# EAGLE design Varmo_Screen (EAGLE 7.6.0)
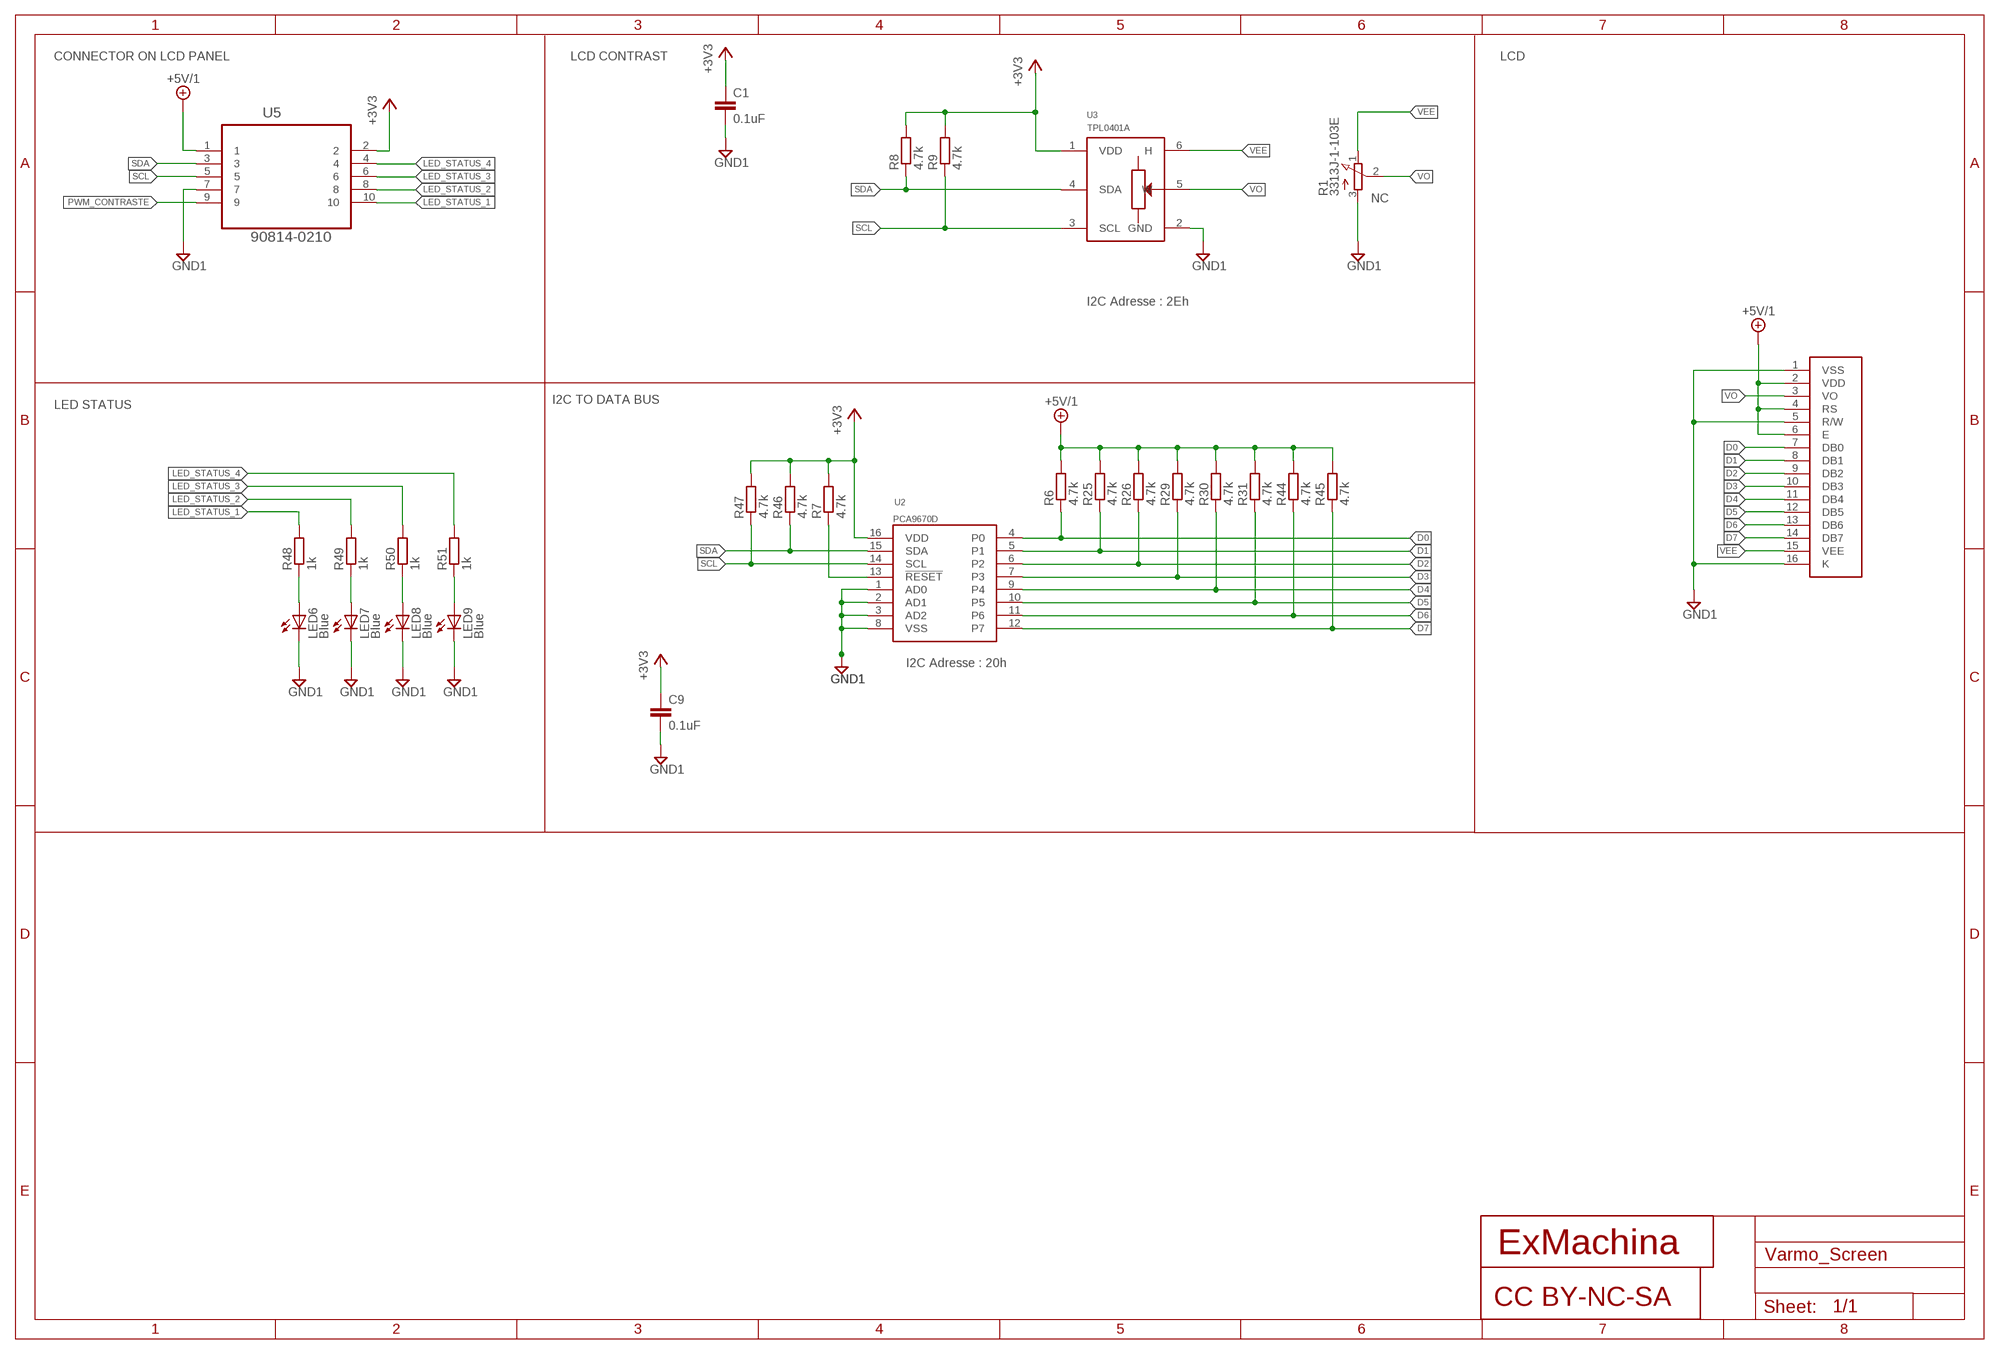
[diagram p0: schematic, sheet 1]

## Parts
C1  0.1uF  C-EUC0603  [C0603]
C9  0.1uF  C-EUC0603  [C0603]
LCD1  MC41605A12W  [CONNECTOR]
LED6  Blue  LEDCHIP-LED0603  [CHIP-LED0603]
LED7  Blue  LEDCHIP-LED0603  [CHIP-LED0603]
LED8  Blue  LEDCHIP-LED0603  [CHIP-LED0603]
LED9  Blue  LEDCHIP-LED0603  [CHIP-LED0603]
R1  3313J-1-103E  [3313J]
R6  4.7k  R-EU_R0603  [R0603]
R7  4.7k  R-EU_R0603  [R0603]
R8  4.7k  R-EU_R0603  [R0603]
R9  4.7k  R-EU_R0603  [R0603]
R25  4.7k  R-EU_R0603  [R0603]
R26  4.7k  R-EU_R0603  [R0603]
R29  4.7k  R-EU_R0603  [R0603]
R30  4.7k  R-EU_R0603  [R0603]
R31  4.7k  R-EU_R0603  [R0603]
R44  4.7k  R-EU_R0603  [R0603]
R45  4.7k  R-EU_R0603  [R0603]
R46  4.7k  R-EU_R0603  [R0603]
R47  4.7k  R-EU_R0603  [R0603]
R48  1k  R-EU_R0603  [R0603]
R49  1k  R-EU_R0603  [R0603]
R50  1k  R-EU_R0603  [R0603]
R51  1k  R-EU_R0603  [R0603]
U2  PCA9670D  [SOT162-1]
U3  TPL0401A  [SC-70-DCK]
U5  90814-0210  [MOLEX_90814-0210]
U$5  CC-BY-NC-SA  [CC-BY-NC-SA]
U$7  EXMACHINA-LOGO-NAME  [EXM-LOGO-BASELINE]

## Nets
+3V3: C1.1 C9.1 R7.2 R8.2 R9.2 R46.2 R47.2 U2.16(VDD) U3.1(VDD) U5.2
+5V/1: LCD1.2(VDD) LCD1.4(RS) LCD1.6(E) R6.2 R25.2 R26.2 R29.2 R30.2 R31.2 R44.2 R45.2 U5.1
D0: LCD1.7(DB0) R6.1 U2.4(P0)
D1: LCD1.8(DB1) R25.1 U2.5(P1)
D2: LCD1.9(DB2) R26.1 U2.6(P2)
D3: LCD1.10(DB3) R29.1 U2.7(P3)
D4: LCD1.11(DB4) R30.1 U2.9(P4)
D5: LCD1.12(DB5) R31.1 U2.10(P5)
D6: LCD1.13(DB6) R44.1 U2.11(P6)
D7: LCD1.14(DB7) R45.1 U2.12(P7)
GND1: C1.2 C9.2 LCD1.1(VSS) LCD1.5(R/W) LCD1.16(K) LED6.C LED7.C LED8.C LED9.C R1.3(A) U2.1(AD0) U2.2(AD1) U2.3(AD2) U2.8(VSS) U3.2(GND) U5.7
LED_STATUS_1: R48.2 U5.10
LED_STATUS_2: R49.2 U5.8
LED_STATUS_3: R50.2 U5.6
LED_STATUS_4: R51.2 U5.4
N$1: R7.1 U2.13(!RESET)
N$4: LED6.A R48.1
N$22: LED7.A R49.1
N$24: LED8.A R50.1
N$29: LED9.A R51.1
PWM_CONTRASTE: U5.9
SCL: R9.1 R47.1 U2.14(SCL) U3.3(SCL) U5.5
SDA: R8.1 R46.1 U2.15(SDA) U3.4(SDA) U5.3
VEE: LCD1.15(VEE) R1.1(E) U3.6(H)
VO: LCD1.3(VO) R1.2(S) U3.5(W)

## Notes on the sheet
- CONNECTOR ON LCD PANEL | LCD CONTRAST | LCD
- NC
- I2C Adresse : 2Eh
- I2C TO DATA BUS
- LED STATUS
- I2C Adresse : 20h

## Library data of the parts
C1 C9 = rcl:C-EU: CAPACITOR, European symbol
LCD1 = midas:MC41605A12W
LED6-LED9 = led:LED: LED OSRAM: - CHIPLED LG R971, LG N971, LY N971, LG Q971, LY Q971, LO R971, LY R971 LH N974, LH R974 LS Q976, LO Q976, LY Q976 LO Q996 - Hyper CHIPLED LW Q18S LB Q993, LB Q99A, LB R99A - SideLED LS A670, LO A670, LY A670, LG A670, LP A670 LB A673, LV A673, LT A673, LW A673 LH A674 LY A675 LS A676, LA A676, LO A676, LY A676, LW A676 LS A679, LY A679, LG A679 - Hyper Micro SIDELED® LS Y876, LA Y876, LO Y876, LY Y876 LT Y87S - SmartLED LW L88C, LW L88S LB L89C, LB L89S, LG L890 LS L89K, LO L89K, LY L89K LS L896, LA L896, LO L896, LY L896 - TOPLED LS T670, LO T670, LY T670, LG T670, LP T670 LSG T670, LSP T670, LSY T670, LOP T670, LYG T670 LG T671, LOG T671, LSG T671 LB T673, LV T673, LT T673, LW T673 LH T674 LS T676, LA T676, LO T676, LY T676, LB T676, LH T676, LSB T676, LW T676 LB T67C, LV T67C, LT T67C, LS T67K, LO T67K, LY T67K, LW E67C LS E67B, LA E67B, LO E67B, LY E67B, LB E67C, LV E67C, LT E67C LW T67C LS T679, LY T679, LG T679 LS T770, LO T770, LY T770, LG T770, LP T770 LB T773, LV T773, LT T773, LW T773 LH T774 LS E675, LA E675, LY E675, LS T675 LS T776, LA T776, LO T776, LY T776, LB T776 LHGB T686 LT T68C, LB T68C - Hyper Mini TOPLED® LB M676 - Mini TOPLED Santana® LG M470 LS M47K, LO M47K, LY M47K Source: http://www.osram.convergy.de LUXEON: - LUMILED® LXK2-PW12-R00, LXK2-PW12-S00, LXK2-PW14-U00, LXK2-PW14-V00 LXK2-PM12-R00, LXK2-PM12-S00, LXK2-PM14-U00 LXK2-PE12-Q00, LXK2-PE12-R00, LXK2-PE12-S00, LXK2-PE14-T00, LXK2-PE14-U00 LXK2-PB12-K00, LXK2-PB12-L00, LXK2-PB12-M00, LXK2-PB14-N00, LXK2-PB14-P00, LXK2-PB14-Q00 LXK2-PR12-L00, LXK2-PR12-M00, LXK2-PR14-Q00, LXK2-PR14-R00 LXK2-PD12-Q00, LXK2-PD12-R00, LXK2-PD12-S00 LXK2-PH12-R00, LXK2-PH12-S00 LXK2-PL12-P00, LXK2-PL12-Q00, LXK2-PL12-R00 Source: www.luxeon.com KINGBRIGHT: KA-3528ASYC Source: www.kingbright.com
R1 = pot:3313J
R6-R9 R25 R26 R29-R31 R44-R51 = rcl:R-EU_: RESISTOR, European symbol
U2 = NXP:PCA9670D: Interface - I/O Expanders 8-BIT I2C FM+ QB
U3 = ti:TPL0401
U5 = Molex_By_element14_Batch_1:90814-0210: CONN HEADER 10POS 1.27MM SMD TIN; MPN: 90814-0210; OC_FARNELL: 1757026; OC_NEWARK: 34R6217; PACKAGE: CONN-10POS; SUPPLIER: Molex
U$5 = cc-by-sa:CC-BY-NC-SA
U$7 = exmachina:EXMACHINA-LOGO

## Net classes
0 default: width 0.178 mm, drill 0.35 mm
1 power: width 0.406 mm, drill 0.013 mm

## Board
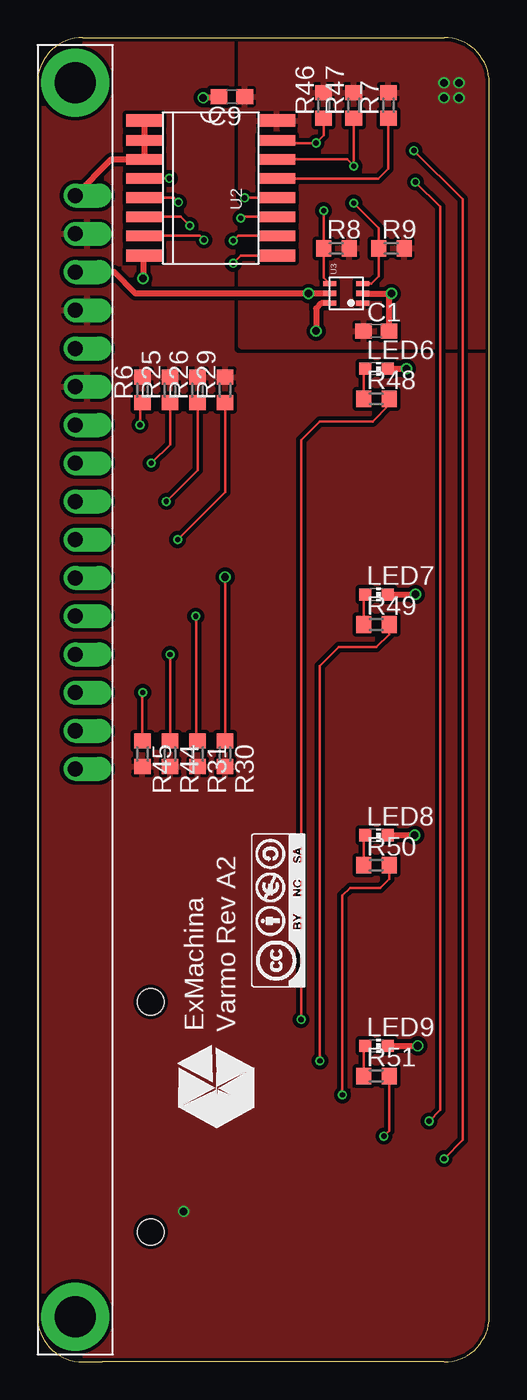
[diagram p1: board, top side]
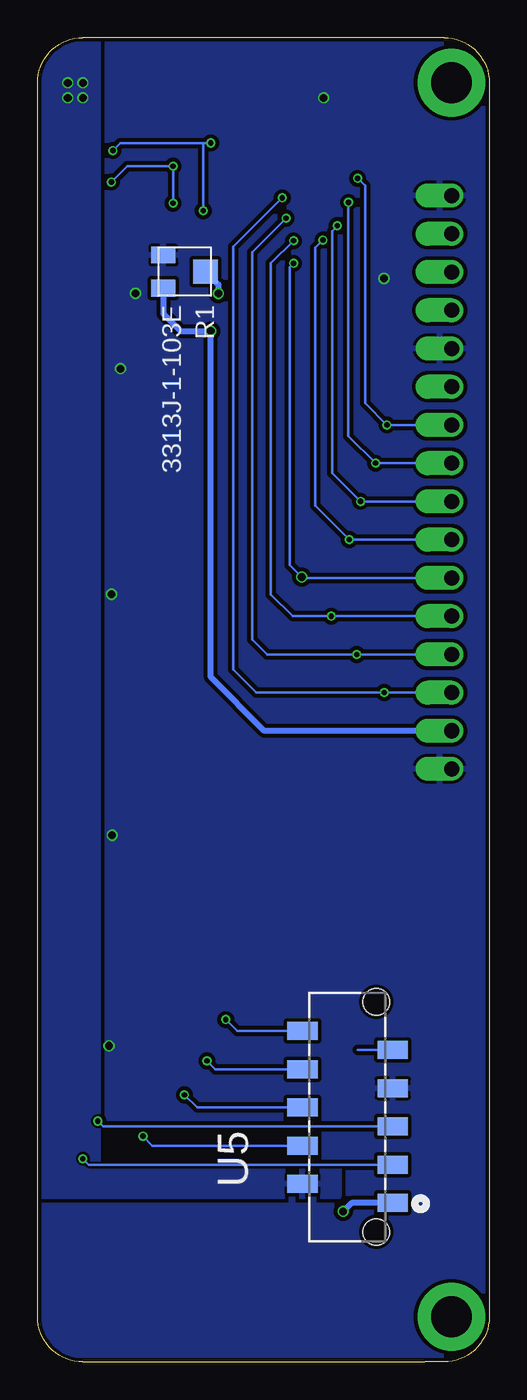
[diagram p2: board, bottom side, seen from below]

Size 30 x 88 mm. Coordinates in mm from the lower left corner, seen from the top.
Outline: 4.29,0 3,0 arc-90 0,3 0,85 arc-90 3,88 27,88 arc-90 30,85 30,3 arc-90 27,0 4.3,0
Copper layers (1*16): Top 0.018mm / dielectric 1.55mm / Bottom 0.018mm
Design rules "eC_2Layer_PClass6_BaseCopperO18_eCDefault *": minimum track width 7mil, minimum drill 0.35mm, track to track 0.15mm, track to pad 0.15mm, pad to pad 0.15mm, via to via 0.15mm, smd to smd 0mil, copper to edge 0.25mm, drill to drill 0.35mm, minimum pad ring 0.175mm, minimum via ring 0.125mm, stop-mask expansion 0mil, vias tented up to drill 0.45mm, thermal gap 0.2mm

### Footprints (pad centres in the part's own frame; a part is rotated, then mirrored left to right if it is on the bottom)
C0603 = smd 1.1 x 1: 1 -0.85,0; 2 0.85,0
CONNECTOR = drill 1 pad 1.6 offset: 1 -33.5,0; 2 -30.96,0; 3 -28.42,0; 4 -25.88,0; 5 -23.34,0; 6 -20.8,0; 7 -18.26,0; 8 -15.72,0; 9 -13.18,0; 10 -10.64,0; 11 -8.1,0; 12 -5.56,0; 13 -3.02,0; 14 -0.48,0; 15 2.06,0; 16 4.6,0 | drill 2.7 pad 4.5: 33 -41,0; 36 41,0
CHIP-LED0603 = smd 0.8 x 0.8: A 0,-0.75; C 0,0.75
3313J = smd 1.1 x 1.6: 1 1.1,-1.4; 3 -1.1,-1.4 | smd 1.6 x 1.6: 2 0,1.4
R0603 = smd 1 x 1.1: 1 -0.85,0; 2 0.85,0
SOT162-1 = smd 0.8 x 2.4: 1 -4.495,-4.4; 8 4.495,-4.4; 9 4.495,4.4; 16 -4.495,4.4 | smd 0.7 x 2.4: 2 -3.175,-4.4; 3 -1.905,-4.4; 4 -0.635,-4.4; 5 0.635,-4.4; 6 1.905,-4.4; 7 3.175,-4.4; 10 3.175,4.4; 11 1.905,4.4; 12 0.635,4.4; 13 -0.635,4.4; 14 -1.905,4.4; 15 -3.175,4.4
SC-70-DCK = smd 0.35 x 0.85: 1 -0.65,-1.1; 2 0,-1.1; 3 0.65,-1.1; 4 0.65,1.1; 5 0,1.1; 6 -0.65,1.1
MOLEX_90814-0210 = smd 1.194 x 2.007: 1 0,0; 2 1.27,5.994; 3 2.54,0; 4 3.81,5.994; 5 5.08,0; 6 6.35,5.994; 7 7.62,0; 8 8.89,5.994; 9 10.16,0; 10 11.43,5.994 | hole 1.753: -1.93,1.092; 13.36,1.092

### Placement (x,y rotation side)
C1  22.5,68.5 0 top
C9  12.91,84.08 180 top
LCD1  2.5,44 270 top
LED6  22.5,66 270 top
LED7  22.5,51 270 top
LED8  22.5,35 270 top
LED9  22.5,21 270 top
R1  20.25,72.45 270 bottom
R6  6.96,64.59 90 top
R7  23.3,83.5 90 top
R8  19.85,74 0 top
R9  23.5,74 0 top
R25  8.79,64.59 90 top
R26  10.62,64.59 90 top
R29  12.46,64.59 90 top
R30  12.46,40.41 270 top
R31  10.62,40.41 270 top
R44  8.79,40.41 270 top
R45  6.96,40.41 270 top
R46  19,83.5 90 top
R47  21,83.5 90 top
R48  22.5,64 0 top
R49  22.5,49 0 top
R50  22.5,33 0 top
R51  22.5,19 0 top
U2  11.5,78 270 top
U3  20.5,71 90 top
U5  6.42,10.56 90 bottom
U$5  16,30 90 top
U$7  11.9,18.2 90 top

### Tracks (layer width: path | path; a pad name or v marks a point on that pad's centre or on a via)
+3V3  (via drill 0.5)
  other vias: 28,84 28,85 27,85 27,84
  pour Bottom: 26,88.5 26,13 10,13 10,11 31,11 31,88.5
  pour Top (isolate 0.254): 13.5,89 13.5,67.5 30,67.5 31,89
+5V/1  (via drill 0.5)
  Bottom 0.406: U5.1 9.14,10.56 v9.7,10
  pour Top (isolate 0.254, rank 3): 36,-6 36,95 -6,95 -6,-6
D0  (via drill 0.35)
  Top 0.178: R6.1 6.8,63.58 v6.8,62.26 | v8.75,78.65 7.12,78.65 U2.4
  Bottom 0.178: LCD1.7 v6.8,62.26 8.25,63.71 8.25,78.15 v8.75,78.65
D1  (via drill 0.35)
  Top 0.178: v7.55,59.72 8.79,60.97 R25.1 | v9.35,77.05 9.04,77.36 U2.5
  Bottom 0.178: LCD1.8 v7.55,59.72 9.35,61.52 v9.35,77.05
D2  (via drill 0.35)
  Top 0.178: v8.55,57.18 10.62,59.26 R26.1 | v10.1,75.5 9.51,76.09 U2.6
  Bottom 0.178: LCD1.9 v8.55,57.18 10.45,59.08 10.45,75.16 v10.1,75.5
D3  (via drill 0.35)
  Top 0.178: v9.3,54.64 12.46,57.8 R29.1 | U2.7 10.78,74.83 v11.05,74.55
  Bottom 0.178: LCD1.10 v9.3,54.64 11.56,56.91 11.56,74.03 v11.05,74.55
D4  (via drill 0.35, 0.5)
  Top 0.178: R30.1 v12.46,52.16 | v13,73 13.51,73.5 U2.9
  Bottom 0.178: LCD1.11 12.4,52.1 v12.46,52.16 13.25,52.95 13.25,72.75 v13,73
D5  (via drill 0.35)
  Top 0.178: R31.1 10.55,41.34 10.55,49.5 v10.5,49.55 | v13,74.5 13.32,74.83 U2.10
  Bottom 0.178: LCD1.12 10.48,49.56 arc-45 v10.5,49.55 13.05,49.55 14.5,51 14.5,73 v13,74.5
D6  (via drill 0.35)
  Top 0.178: R44.1 v8.8,47 | v13.5,76 13.6,76.09 U2.11
  Bottom 0.178: LCD1.13 8.75,47.02 arc-45 v8.8,47 14.75,47 15.75,48 15.75,73.75 v13.5,76
D7  (via drill 0.35)
  Top 0.178: R45.1 6.96,44.47 v6.98,44.48 | v13.75,77.35 15.88,77.35 U2.12
  Bottom 0.178: LCD1.14 v6.98,44.48 15.48,44.48 17,46 17,74.1 v13.75,77.35
GND1  (via drill 0.5)
  Top 0.406: LED7.C v25.1,51 | LED8.C v25.05,35 | LED9.C v25.25,21 | 7,81.08 U2.2 | U2.2 7.1,80.09 7,80 U2.3 4.91,79.91 LCD1.1 | U2.2 U2.1 | U2.8 7,73.41 v7,72 | LED6.C v24.5,66 | U3.2 v23.5,71 23.35,70.85 C1.2 | C9.2 11.98,84 v11,84
  pour Bottom (isolate 0.254, rank 3): -6,95 -6,-6 36,-6 36,95
LED_STATUS_1  (via drill 0.35)
  Top 0.178: v17.5,22.75 17.5,61.25 18.75,62.5 22.25,62.5 23.35,63.6 R48.2
  Bottom 0.178: U5.10 16.74,21.99 v17.5,22.75
LED_STATUS_2  (via drill 0.35)
  Top 0.178: v18.75,20 18.75,46.25 20,47.5 22.5,47.5 23.35,48.35 R49.2
  Bottom 0.178: U5.8 18.2,19.45 v18.75,20
LED_STATUS_3  (via drill 0.35)
  Top 0.178: v20.25,17.75 20.25,31 20.75,31.5 22.75,31.5 23.35,32.1 R50.2
  Bottom 0.178: U5.6 19.41,16.91 v20.25,17.75
LED_STATUS_4  (via drill 0.35)
  Top 0.178: v23,15 23.35,15.35 R51.2
  Bottom 0.178: U5.4 22.37,14.37 v23,15
N$1
  Top 0.178: 15.98,78.55 U2.13 22.64,78.64 23.3,79.3 R7.1
N$4
  Top 0.178: R48.1 21.65,65.9 LED6.A
N$22
  Top 0.178: R49.1 21.65,50.9 LED7.A
N$24
  Top 0.178: R50.1 21.65,34.9 LED8.A
N$29
  Top 0.178: R51.1 21.65,20.9 LED9.A
PWM_CONTRASTE
  Bottom 0.178: U5.9 8.72,20.72
SCL  (via drill 0.35)
  Top 0.178: v26,16 26.75,16.75 26.75,76.75 v25.09,78.41 | v21,77 22.65,75.35 R9.1 22.65,72.15 22.15,71.65 U3.3 | R47.1 v21,79.46 20.55,79.91 U2.14
  Bottom 0.178: v26,16 25.64,15.64 U5.5 | v21,77 v21,79.46 24.04,79.46 v25.09,78.41
SDA  (via drill 0.35)
  Top 0.178: v27,13.5 28.25,14.75 28.25,77.25 v25,80.5 | R46.1 19,81.5 v18.5,81 16.07,81 U2.15 | U3.4 19,72.05 R8.1 v19,76.5
  Bottom 0.178: v27,13.5 26.6,13.1 U5.3 | 19,81 v18.5,81 | v19,76.5 19,81 | v25,80.5 24.5,81 19,81
VEE  (via drill 0.5)
  Top 0.406: U3.6 18.85,70.35 18.5,70 v18.5,68.5
  Bottom 0.406: LCD1.15 14.94,41.94 18.5,45.5 v18.5,68.5 20.5,68.5 21.65,69.65 R1.1
VO  (via drill 0.5)
  Top 0.406: U3.5 v18,71 6.5,71 5.08,72.42 LCD1.3
  Bottom 0.406: R1.2 18,71.6 v18,71

### Text on the board
tPlace: Varmo Rev A2